# EAGLE schematic Thetis_RevF4_SCH (EAGLE 9.7.0)
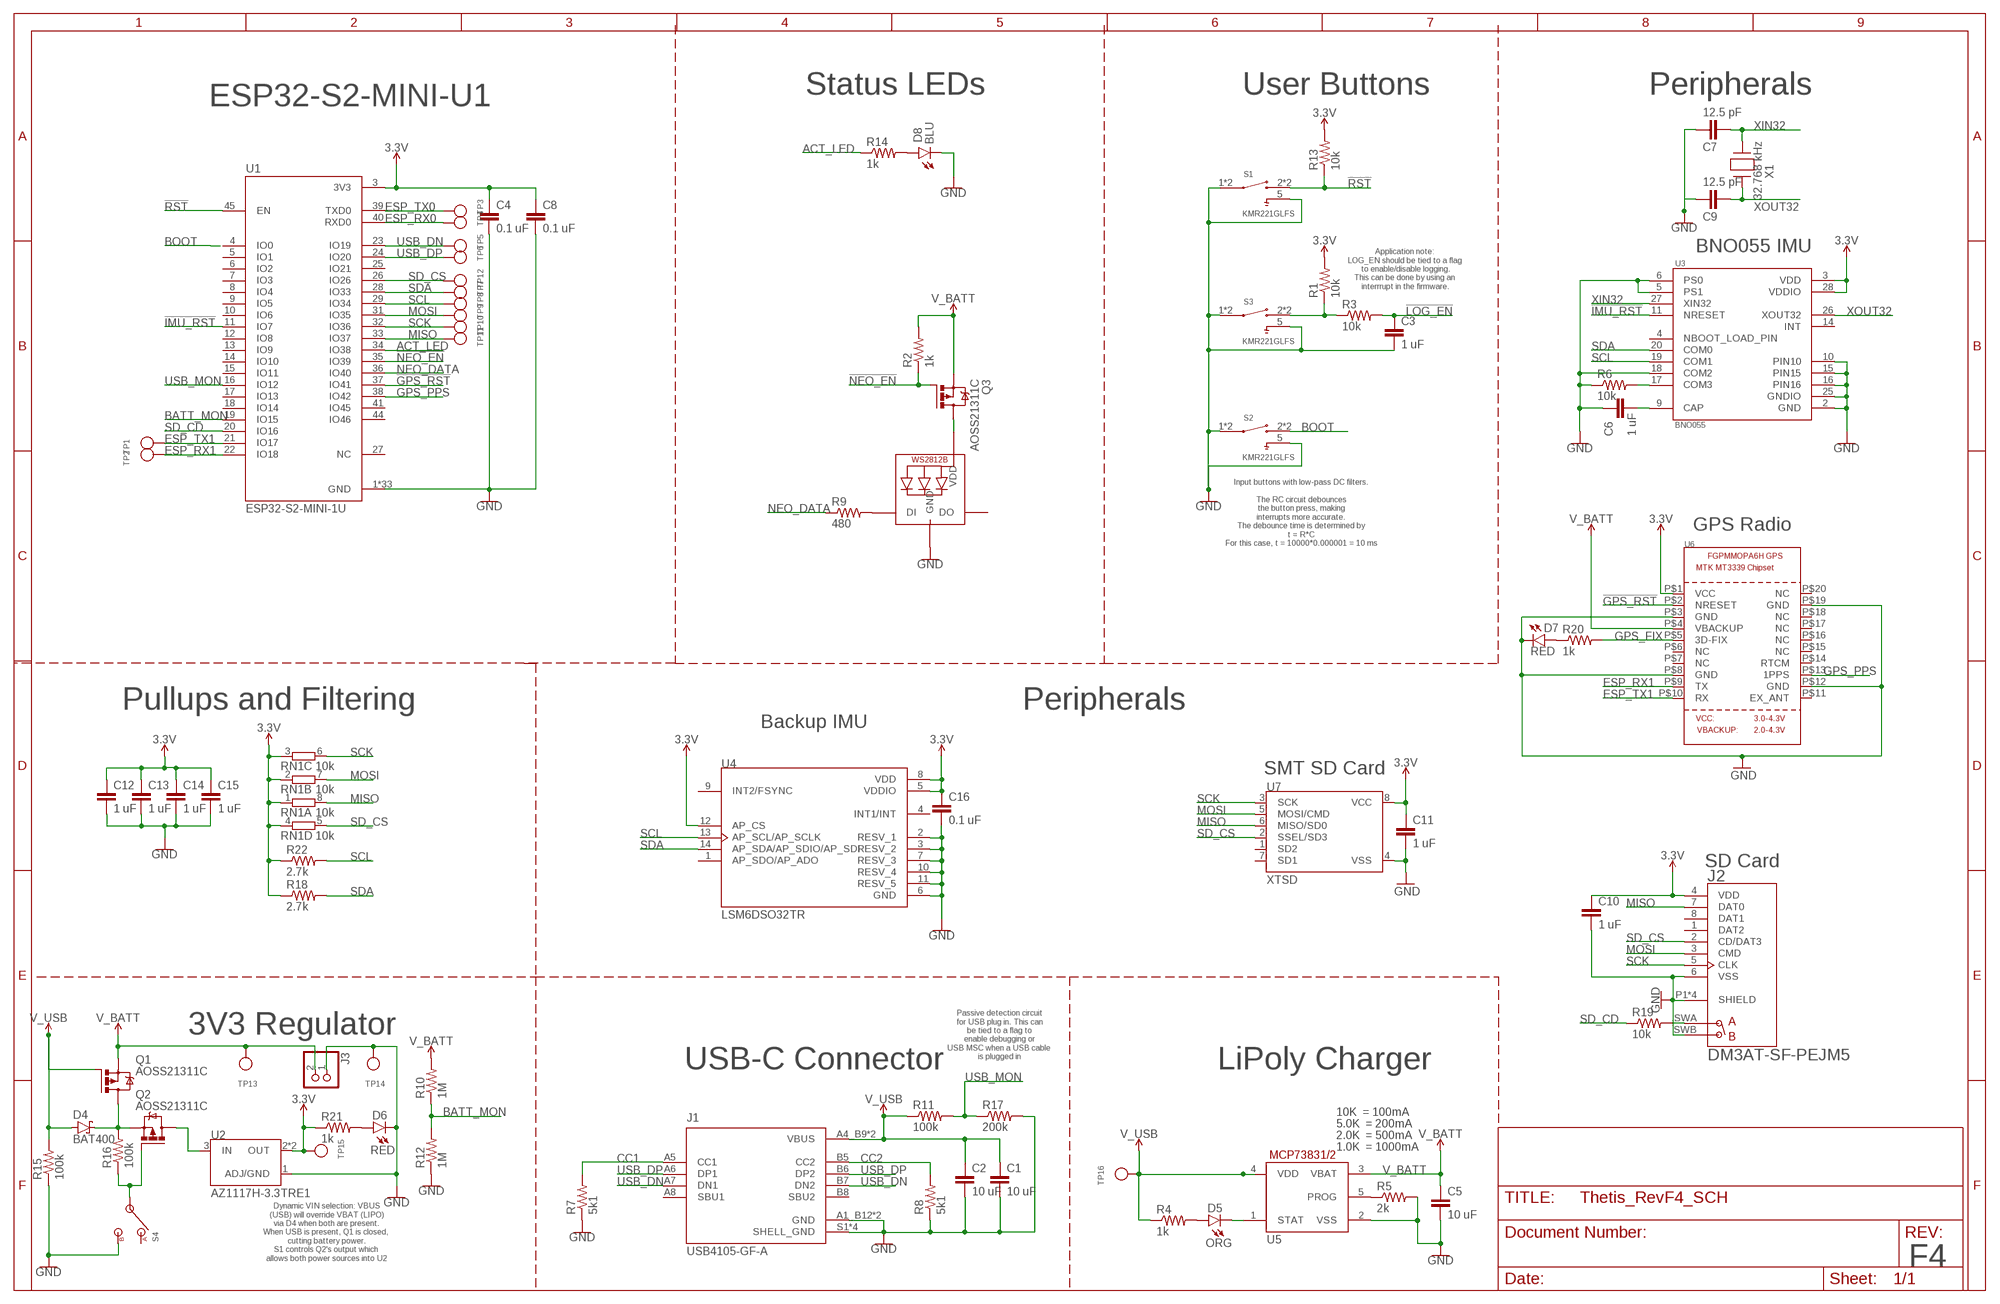
[diagram p0: schematic, sheet 1]

## Parts
C1  10 uF  C-EUC0603  [C0603]
C2  10 uF  C-EUC0603  [C0603]
C3  1 uF  C-EUC0603  [C0603]
C4  0.1 uF  C-EUC0603  [C0603]
C5  10 uF  C-EUC0603  [C0603]
C6  1 uF  C-EUC0603  [C0603]
C7  12.5 pF  C-EUC0603  [C0603]
C8  0.1 uF  C-EUC0603  [C0603]
C9  12.5 pF  C-EUC0603  [C0603]
C10  1 uF  C-EUC0603  [C0603]
C11  1 uF  C-EUC0603  [C0603]
C12  1 uF  C-EUC0603  [C0603]
C13  1 uF  C-EUC0603  [C0603]
C14  1 uF  C-EUC0603  [C0603]
C15  1 uF  C-EUC0603  [C0603]
C16  0.1 uF  C-EUC0603  [C0603]
D4  BAT400  BAS40  [SOT23]
D5  ORG  CHIP-ROUND-G_0603  [LEDC1608X65N]
D6  RED  CHIP-ROUND-G_0603  [LEDC1608X65N]
D7  RED  CHIP-FLAT-Y_0603-0.35MM  [LEDC1608X35N]
D8  BLU  CHIP-ROUND-G_0603  [LEDC1608X65N]
J1  USB4105-GF-A  [GCT_USB4105-GF-A]
J2  DM3AT-SF-PEJM5  [HRS_DM3AT-SF-PEJM5]
J3  JST_2PIN  [JSTPH2]
LED1  WS2812B3535  [LED3535]
Q1  AOSS21311C  PMOSFET_BSS84  [SOT23]
Q2  AOSS21311C  PMOSFET_BSS84  [SOT23]
Q3  AOSS21311C  PMOSFET_BSS84  [SOT23]
R1  10k  R-US_R0603  [R0603]
R2  1k  R-US_R0603  [R0603]
R3  10k  R-US_R0603  [R0603]
R4  1k  R-US_R0603  [R0603]
R5  2k  R-US_R0603  [R0603]
R6  10k  R-US_R0603  [R0603]
R7  5k1  R-US_R0603  [R0603]
R8  5k1  R-US_R0603  [R0603]
R9  480  R-US_R0603  [R0603]
R10  1M  R-US_R0603  [R0603]
R11  100k  R-US_R0603  [R0603]
R12  1M  R-US_R0603  [R0603]
R13  10k  R-US_R0603  [R0603]
R14  1k  R-US_R0603  [R0603]
R15  100k  R-US_R0603  [R0603]
R16  100k  R-US_R0603  [R0603]
R17  200k  R-US_R0603  [R0603]
R18  2.7k  R-US_R0603  [R0603]
R19  10k  R-US_R0603  [R0603]
R20  1k  R-US_R0603  [R0603]
R21  1k  R-US_R0603  [R0603]
R22  2.7k  R-US_R0603  [R0603]
RN1  10k  4R-NEXBN8V  [EXBN8V]
S1  KMR221GLFS  [SW_KMR221GLFS]
S2  KMR221GLFS  [SW_KMR221GLFS]
S3  KMR221GLFS  [SW_KMR221GLFS]
S4  CL-SB-12X  [CL-SB-12A]
TP1  TESTPOINT1.5X2.0MM_NOCREAM  [PAD-1.5X2.0]
TP2  TESTPOINT1.5X2.0MM_NOCREAM  [PAD-1.5X2.0]
TP3  TESTPOINT1.5X2.0MM_NOCREAM  [PAD-1.5X2.0]
TP4  TESTPOINT1.5X2.0MM_NOCREAM  [PAD-1.5X2.0]
TP5  TESTPOINT1.5X2.0MM_NOCREAM  [PAD-1.5X2.0]
TP6  TESTPOINT1.5X2.0MM_NOCREAM  [PAD-1.5X2.0]
TP7  TESTPOINT1.5X2.0MM_NOCREAM  [PAD-1.5X2.0]
TP8  TESTPOINT1.5X2.0MM_NOCREAM  [PAD-1.5X2.0]
TP9  TESTPOINT1.5X2.0MM_NOCREAM  [PAD-1.5X2.0]
TP10  TESTPOINT1.5X2.0MM_NOCREAM  [PAD-1.5X2.0]
TP11  TESTPOINT1.5X2.0MM_NOCREAM  [PAD-1.5X2.0]
TP12  TESTPOINT1.5X2.0MM_NOCREAM  [PAD-1.5X2.0]
TP13  TESTPOINT1.5X2.0MM_NOCREAM  [PAD-1.5X2.0]
TP14  TESTPOINT1.5X2.0MM_NOCREAM  [PAD-1.5X2.0]
TP15  TESTPOINT1.5X2.0MM_NOCREAM  [PAD-1.5X2.0]
TP16  TESTPOINT1.5X2.0MM_NOCREAM  [PAD-1.5X2.0]
U1  ESP32-S2-MINI-1U  [XCVR_ESP32-S2-MINI-1U]
U2  AZ1117H-3.3TRE1  AZ1117EH-5.0TRG1  [SOT230P700X180-4N]
U3  BNO055  [LGA28R50P4X10_380X520X100]
U4  LSM6DSO32TR  [PQFN50P300X250X97-14N]
U5  MCP73831/OT  [SOT23-5L]
U6  GPS_FGPMMOPA6H  [FGPMMOPA6H]
U7  XTSD  SMT_SDCARD_8PIN  [LGA8_8X6]
X1  32.768 kHz  RT3215-32.768-12.5-TRRT3215_RAL-L  [RT3215_RAL-L]

## Nets
3.3V: C4.1 C8.1 C10.1 C11.1 C12.1 C13.1 C14.1 C15.1 C16.1 J2.4(VDD) R1.2 R13.2 R18.1 R21.1 R22.1 RN1.1 RN1.2 RN1.3 RN1.4 TP15.P$1 U1.3(3V3) U2.2(OUT) U2.4(OUT) U3.3(VDD) U3.28(VDDIO) U4.5(VDDIO) U4.8(VDD) U4.12(AP_CS) U6.P$1(VCC) U7.8(VCC)
!GPS_RST: U1.37(IO41) U6.P$2(NRESET)
!IMU_RST: U1.11(IO7) U3.11(NRESET)
!LOG_EN: C3.1 R3.2
!NEO_EN: Q3.1(G) R2.1 U1.35(IO39)
!RST: R13.1 S1.2 S1.3 U1.45(EN)
ACT_LED: R14.1 U1.34(IO38)
BATT_MON: R10.1 R12.2 U1.19(IO15)
BOOT: S2.2 S2.3 U1.4(IO0)
CC1: J1.A5(CC1) R7.2
CC2: J1.B5(CC2) R8.2
ESP_RX0: TP4.P$1 U1.40(RXD0)
ESP_RX1: TP2.P$1 U1.22(IO18) U6.P$9(TX)
ESP_TX0: TP3.P$1 U1.39(TXD0)
ESP_TX1: TP1.P$1 U1.21(IO17) U6.P$10(RX)
GND: C1.2 C2.2 C3.2 C4.2 C5.2 C6.1 C7.1 C8.2 C9.1 C10.2 C11.2 C12.2 C13.2 C14.2 C15.2 C16.2 D6.C D7.C D8.C J1.A1_B12(GND) J1.B1_A12(GND) J1.S1(SHELL_GND) J1.S2(SHELL_GND) J1.S3(SHELL_GND) J1.S4(SHELL_GND) J2.6(VSS) J2.P1(SHIELD) J2.P2(SHIELD) J2.P3(SHIELD) J2.P4(SHIELD) J2.SWB(B) J3.1 LED1.4(GND) R5.2 R6.1 R7.1 R8.1 R12.1 R15.1 R17.2 S1.1 S1.4 S1.5 S2.1 S2.4 S2.5 S3.1 S3.4 S3.5 S4.3 TP14.P$1 U1.1(GND) U1.2(GND) U1.30(GND) U1.42(GND) U1.43(GND) U1.46(GND) U1.47(GND) U1.48(GND) U1.49(GND) U1.50(GND) U1.51(GND) U1.52(GND) U1.53(GND) U1.54(GND) U1.55(GND) U1.56(GND) U1.57(GND) U1.58(GND) U1.59(GND) U1.60(GND) U1.61_0(GND) U1.61_1(GND) U1.61_2(GND) U1.61_3(GND) U1.61_4(GND) U1.61_5(GND) U1.61_6(GND) U1.61_7(GND) U1.61_8(GND) U1.62(GND) U1.63(GND) U1.64(GND) U1.65(GND) U2.1(ADJ/GND) U3.2(GND) U3.5(PS1) U3.6(PS0) U3.10(PIN10) U3.15(PIN15) U3.16(PIN16) U3.18(COM2) U3.25(GNDIO) U4.2(RESV_1) U4.3(RESV_2) U4.6(GND) U4.7(RESV_3) U4.10(RESV_4) U4.11(RESV_5) U5.2(VSS) U6.P$3(GND) U6.P$8(GND) U6.P$12(GND) U6.P$19(GND) U7.4(VSS)
GPS_FIX: R20.2 U6.P$5(3D-FIX)
GPS_PPS: U1.38(IO42) U6.P$13(1PPS)
MISO: J2.7(DAT0) RN1.8 TP11.P$1 U1.33(IO37) U7.6(MISO/SD0)
MOSI: J2.3(CMD) RN1.7 TP9.P$1 U1.31(IO35) U7.5(MOSI/CMD)
N$1: Q2.1(G) R16.1 S4.2
N$2: D7.A R20.1
N$3: D8.A R14.2
N$4: R1.1 R3.1 S3.2 S3.3
N$5: LED1.2(VDD) Q3.3(D)
N$6: Q2.3(D) U2.3(IN)
N$7: R6.2 U3.17(COM3)
N$8: LED1.1(DI) R9.2
N$9: C6.2 U3.9(CAP)
N$13: D4.3(C) Q1.3(D) Q2.2(S) R16.2
N$20: D5.A R4.2
N$21: D5.C U5.1(STAT)
N$22: R5.1 U5.5(PROG)
N$23: J2.SWA(A) R19.2
N$24: D6.A R21.2
NEO_DATA: R9.1 U1.36(IO40)
SCK: J2.5(CLK) RN1.6 TP10.P$1 U1.32(IO36) U7.3(SCK)
SCL: R22.2 TP8.P$1 U1.29(IO34) U3.19(COM1) U4.13(AP_SCL/AP_SCLK)
SD_CD: R19.1 U1.20(IO16)
SD_CS: J2.2(CD/DAT3) RN1.5 TP12.P$1 U1.26(IO26) U7.2(SSEL/SD3)
SDA: R18.2 TP7.P$1 U1.28(IO33) U3.20(COM0) U4.14(AP_SDA/AP_SDIO/AP_SDI)
USB_DN: J1.A7(DN1) J1.B7(DN2) TP5.P$1 U1.23(IO19)
USB_DP: J1.A6(DP1) J1.B6(DP2) TP6.P$1 U1.24(IO20)
USB_MON: R11.2 R17.1 U1.16(IO12)
V_BATT: C5.1 J3.2 Q1.2(S) Q3.2(S) R2.2 R10.2 TP13.P$1 U5.3(VBAT) U6.P$4(VBACKUP)
V_USB: C1.1 C2.1 D4.1(A) J1.A4_B9(VBUS) J1.B4_A9(VBUS) Q1.1(G) R4.1 R11.1 R15.2 TP16.P$1 U5.4(VDD)
XIN32: C7.2 U3.27(XIN32) X1.1
XOUT32: C9.2 U3.26(XOUT32) X1.2
Unconnected: J1.A8(SBU1) J1.B8(SBU2) J2.1(DAT2) J2.8(DAT1) LED1.3(DO) S4.1 U1.5(IO1) U1.6(IO2) U1.7(IO3) U1.8(IO4) U1.9(IO5) U1.10(IO6) U1.12(IO8) U1.13(IO9) U1.14(IO10) U1.15(IO11) U1.17(IO13) U1.18(IO14) U1.25(IO21) U1.27(NC) U1.41(IO45) U1.44(IO46) U3.4(NBOOT_LOAD_PIN) U3.14(INT) U4.1(AP_SDO/AP_ADO) U4.4(INT1/INT) U4.9(INT2/FSYNC) U6.P$6(NC) U6.P$7(NC) U6.P$11(EX_ANT) U6.P$14(RTCM) U6.P$15(NC) U6.P$16(NC) U6.P$17(NC) U6.P$18(NC) U6.P$20(NC) U7.1(SD2) U7.7(SD1)

## Notes on the sheet
- Status LEDs | User Buttons | Peripherals
- ESP32-S2-MINI-U1
- BNO055 IMU
- Application note: 
  LOG_EN should be tied to a flag 
  to enable/disable logging.
  This can be done by using an 
  interrrupt in the firmware.
- Input buttons with low-pass DC filters.
  
  The RC circuit debounces
  the button press, making
  interrupts more accurate.
  The debounce time is determined by
  t = R*C
  For this case, t = 10000*0.000001 = 10 ms
- GPS Radio
- Pullups and Filtering | Peripherals
- Backup IMU
- SMT SD Card
- SD Card
- 3V3 Regulator
- Passive detection circuit
  for USB plug in. This can
  be tied to a flag to
  enable debugging or
  USB MSC when a USB cable 
  is plugged in
- USB-C Connector | LiPoly Charger
- 10K  = 100mA
- 5.0K  = 200mA
- 2.0K  = 500mA
- 1.0K  = 1000mA
- Dynamic VIN selection: VBUS
  (USB) will override VBAT (LIPO)
  via D4 when both are present.
  When USB is present, Q1 is closed, 
  cutting battery power.
  S1 controls Q2's output which 
  allows both power sources into U2
- F4

## Library data of the parts
C1-C16 = rcl:C-EU: CAPACITOR, European symbol; SPICEPREFIX: C
D4 = diode:BAS40: Silicon Schottky Diodes General-purpose diode for high-speed switching
D5 D6 D8 = LED:CHIP-ROUND-G; CATEGORY: LED; COLOR: GREEN; DESCRIPTION: CHIP LED ROUND; SUB-CATEGORY: CHIP; TYPE: ROUND_TOP
D7 = LED:CHIP-FLAT-Y; CATEGORY: LED; COLOR: YELLOW; DESCRIPTION: CHIP LED FLAT; SUB-CATEGORY: CHIP; TYPE: FLAT_TOP
J1 = USB4105-GF-A:USB4105-GF-A: USB-C (USB TYPE-C) USB 2.0 Receptacle Connector 24 (16+8 Dummy) Position Surface Mount, Right Angle; Through Hole Check prices <https://pricing.snapeda.com/parts/USB4105-GF-A/GCT/view-part?ref=eda>; AVAILABILITY: In Stock; DESCRIPTION: USB-C (USB TYPE-C) USB 2.0 Receptacle Connector 24 (16+8 Dummy) Position Surface Mount, Right Angle; Through Hole; MF: GCT; MP: USB4105-GF-A; PACKAGE: None; PRICE: None; PURCHASE-URL: https://pricing.snapeda.com/search/part/USB4105-GF-A/?ref=eda
J2 = DM3AT-SF-PEJM5:DM3AT-SF-PEJM5: DM3 Series 8 Position Right Angle SMT Push Push Ejection MicroSD Card Connector; AVAILABILITY: Unavailable; DESCRIPTION: DM3 RA SMT microSD memory card push/push; MF: Hirose; MP: DM3AT-SF-PEJM5; PACKAGE: None; PRICE: None
J3 = UTL-Lib:JST_2PIN: JST 2-Pin Right-Angle Connector PH-Series - 4UConnector: 17311 SH-Series - 4UConnector: 07278
LED1 = adafruit:WS2812B
Q1-Q3 = Transistor:PMOSFET_: P-Channel MOSFET - Popular parts; CATEGORY: Transistor; DESCRIPTION: MOSFET P-CH 50V 130MA SOT-23; DRAIN_CURRENT: 130mA; MANUFACTURER: ON Semiconductor; MPN: BSS84; OPERATING_TEMP: -55°C ~ 150°C; PART_STATUS: Active; ROHS_COMPLIANT: Yes; SUB-CATEGORY: MOSFET; THERMALLOSS: 360mW; TYPE: P-Channel; VALUE: BSS84
R1-R22 = rcl:R-US_: RESISTOR, American symbol; SPICEPREFIX: R
RN1 = resistor-dil-Poseidon-Edit:4R-N: Array Chip Resistor Source: RS Component / Phycomp; OC_FARNELL: unknown; OC_NEWARK: unknown
S1-S3 = KMR221GLFS:KMR221GLFS: Switch Tactile N.O. SPST Button Gull Wing 0.05A 32VDC 1VA 200000Cycles 2N SMD Automotive T/R; MANUFACTURER: CnK
S4 = switches:CL-SB-12X: SWITCH SLIDE SPDT 0.2A JLEAD; DIGIKEY: 563-1314-1-ND
TP1-TP16 = microbuilder:TESTPOINT: Test Point Various test points for characterisation and PCB testing TESTPOINT_SMT - Compact Surface Mount Test Point [Digikey: 5016KTR-ND]
U1 = UTL-Lib:ESP32-S2-MINI-1U: WiFi 802.11b/g/n Transceiver Module 2.412GHz - 2.484GHz Antenna Not Included Surface Mount; MANUFACTURER: Espressif Systems; MAXIMUM_PACKAGE_HEIGHT: 2.55mm; PARTREV: 1.0; STANDARD: Manufacturer Recommendations
U2 = AZ1117EH-5.0TRG1:AZ1117EH-5.0TRG1; ARROW_ELECTRONICS-PURCHASE-URL: https://snapeda.com/shop?store=Arrow+Electronics&id=482930; AVAILABILITY: Good; DESCRIPTION: Linear Voltage Regulator IC 1 Output 1A SOT-223; DIGIKEY-PURCHASE-URL: https://snapeda.com/shop?store=DigiKey&id=482930; MF: Diodes Inc.; MOUSER-PURCHASE-URL: https://snapeda.com/shop?store=Mouser&id=482930; MP: AZ1117EH-5.0TRG1; PACKAGE: SOT-223 Diodes Inc.; PRICE: None
U3 = UTL-Lib:BNO055: BNO055 9-axis Absolute Orientation Sensor ( SiP ) w/Sensors and Sensor Fusion; MANUFACTURER: BOSCH
U4 = UTL-Lib:LSM6DSO32TR: Single-Interface MotionTracking device The ICM-42605 is a 6-axis MotionTracking device that combines a 3-axis gyroscope, and a 3-axis accelerometer in a small 2.5x3x0.91 mm (14-pin LGA) package. It also features a 2K-byte FIFO that can lower the traffic on the serial bus interface, and reduce power consumption by allowing the system processor to burst read sensor data and then go into a low-power mode.; MANUFACTURER: TDK Corporation; PARTREV: 0.4; STANDARD: IPC 7351B
U5 = adafruit - EVE Edit:MCP73831: MCP73831/2 Miniature Single-Cell, Fully Integrated Li-Ion, Li-Polymer Charge Management Controllers. Nice and small simple lipoly charge controller, with adjustable current and status output (LED) http://www.ladyada.net/library/pcb/eaglelibrary.html
U6 = adafruit - EVE Edit:GPS_FGPMMOPA6H: GPS Module - MTK MT3339 Chipset, -165dBm sensitivity, 22 channels, 10Hz, auto-select external antenna options
U7 = microbuilder:SMT_SDCARD_8PIN: SOIC8 SPI Flash Be careful with the size since SOIC8 flash comes in several 'widths' SOIC8 150 mil M25P16 - 16Mbit (2Mbit x 8) Serial Flash (75MHz SPI Bus), Supply: 2.7-3.6V Digikey: SOIC8 - M25P16-VMN6P-ND SOIC8 208 mil W25Q16BVSSIG - 16Mbit (2Mbit x 8) Serial Flash (104MHz SPI Bus), Supply: 2.7-3.6V Digikey: SOIC8 - W25Q16BVSSIG-ND
X1 = UTL-Lib:RT3215-32.768-12.5-TR; COPYRIGHT: Copyright (C) 2022 Ultra Librarian. All rights reserved.; DIGI-KEY_PART_NUMBER_1: 2151-RT3215-32.768-12.5-TR-ND; DIGI-KEY_PART_NUMBER_2: 2151-RT3215-32.768-12.5-TRCT-ND; DIGI-KEY_PART_NUMBER_3: 2151-RT3215-32.768-12.5-TRDKR-ND; MANUFACTURER_PART_NUMBER: RT3215-32.768-12.5-TR; MFR_NAME: Raltron

## Net classes
0 default: width 0.178 mm
1 highpower: width 0.305 mm, drill 0.483 mm
2 lowpower: width 0.305 mm, drill 0.483 mm